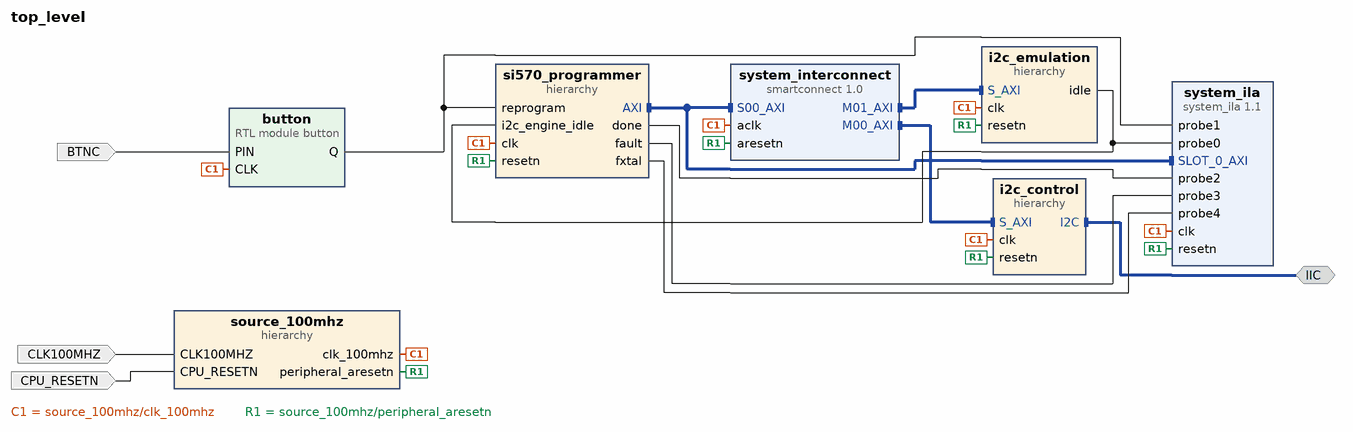
[diagram p0: block diagram of the top level]
# Vivado block design top_level, xc7a100tcsg324-1, Vivado 2021.1
create_bd_design top_level

create_bd_intf_port -mode Master -vlnv xilinx.com:interface:iic_rtl:1.0 IIC
create_bd_port -dir I -type clk CLK100MHZ
set_property -dict {CONFIG.ASSOCIATED_RESET CPU_RESETN} [get_bd_ports CLK100MHZ]
create_bd_port -dir I -type rst CPU_RESETN
create_bd_port -dir I BTNC

create_bd_cell -type hier source_100mhz
create_bd_cell -type hier i2c_control
create_bd_cell -type hier si570_programmer
create_bd_cell -type ip -vlnv xilinx.com:ip:smartconnect:1.0 system_interconnect
set_property -dict {CONFIG.NUM_MI 2 CONFIG.NUM_SI 1} [get_bd_cells system_interconnect]
create_bd_cell -type ip -vlnv xilinx.com:ip:system_ila:1.1 system_ila
set_property -dict {CONFIG.C_DATA_DEPTH 2048 CONFIG.C_MON_TYPE MIX CONFIG.C_NUM_OF_PROBES 5} [get_bd_cells system_ila]
create_bd_cell -type hier i2c_emulation
create_bd_cell -type module -reference button button

# ---- hierarchy /source_100mhz ----
current_bd_instance /source_100mhz
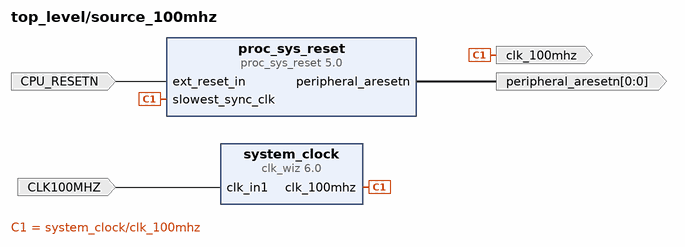
[diagram p1: block diagram inside /source_100mhz]
create_bd_pin -dir I -type clk CLK100MHZ
create_bd_pin -dir O -type clk clk_100mhz
create_bd_pin -dir I -type rst CPU_RESETN
create_bd_pin -dir O -from 0 -to 0 -type rst peripheral_aresetn

create_bd_cell -type ip -vlnv xilinx.com:ip:clk_wiz:6.0 system_clock
set_property -dict [list \
  CONFIG.CLKOUT1_DRIVES BUFGCE \
  CONFIG.CLKOUT2_DRIVES BUFGCE \
  CONFIG.CLKOUT3_DRIVES BUFGCE \
  CONFIG.CLKOUT4_DRIVES BUFGCE \
  CONFIG.CLKOUT5_DRIVES BUFGCE \
  CONFIG.CLKOUT6_DRIVES BUFGCE \
  CONFIG.CLKOUT7_DRIVES BUFGCE \
  CONFIG.CLK_OUT1_PORT clk_100mhz \
  CONFIG.FEEDBACK_SOURCE FDBK_AUTO \
  CONFIG.USE_LOCKED false \
  CONFIG.USE_RESET false \
  CONFIG.USE_SAFE_CLOCK_STARTUP true \
] [get_bd_cells system_clock]
create_bd_cell -type ip -vlnv xilinx.com:ip:proc_sys_reset:5.0 proc_sys_reset

# ---- hierarchy /i2c_control ----
current_bd_instance /i2c_control
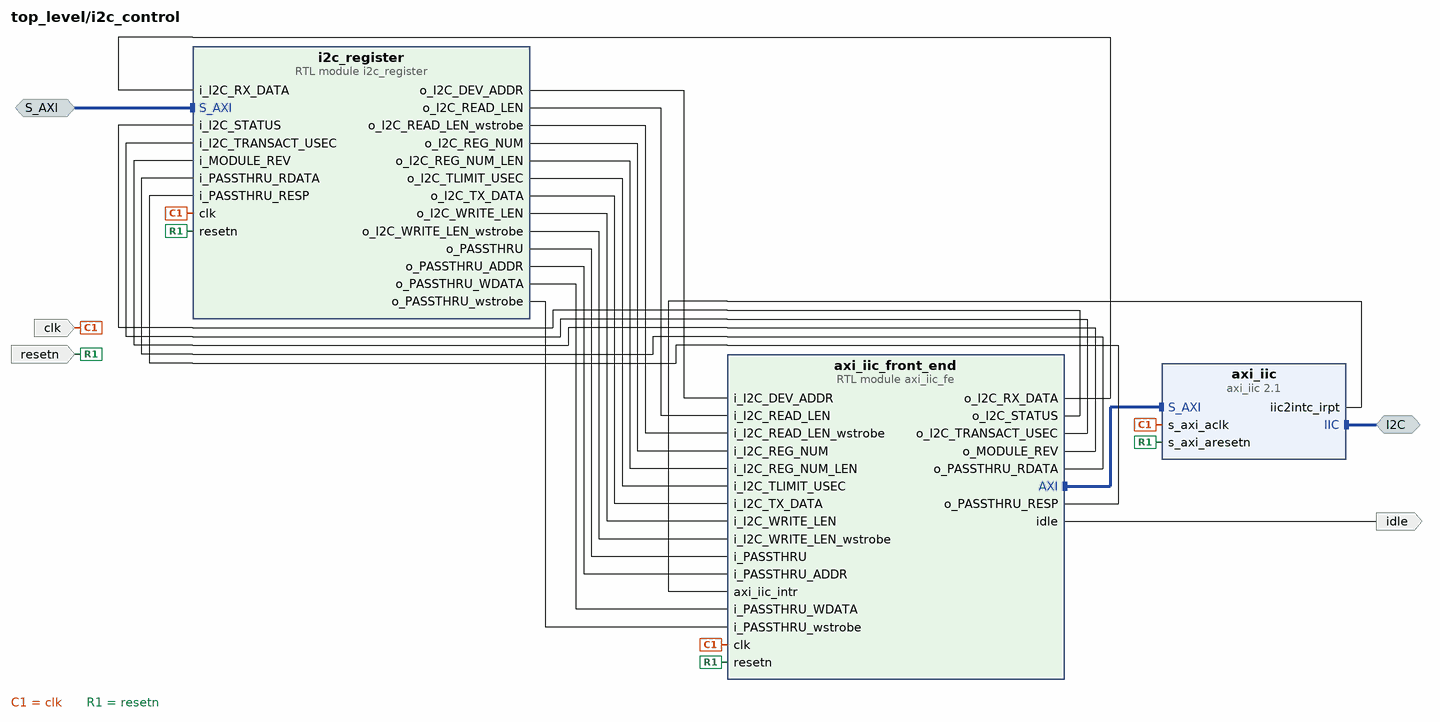
[diagram p2: block diagram inside /i2c_control]
create_bd_intf_pin -mode Master -vlnv xilinx.com:interface:iic_rtl:1.0 I2C
create_bd_intf_pin -mode Slave -vlnv xilinx.com:interface:aximm_rtl:1.0 S_AXI
create_bd_pin -dir I -type clk clk
create_bd_pin -dir I -type rst resetn
create_bd_pin -dir O idle

create_bd_cell -type ip -vlnv xilinx.com:ip:axi_iic:2.1 axi_iic
create_bd_cell -type module -reference axi_iic_fe axi_iic_front_end
create_bd_cell -type module -reference i2c_register i2c_register

# ---- hierarchy /si570_programmer ----
current_bd_instance /si570_programmer
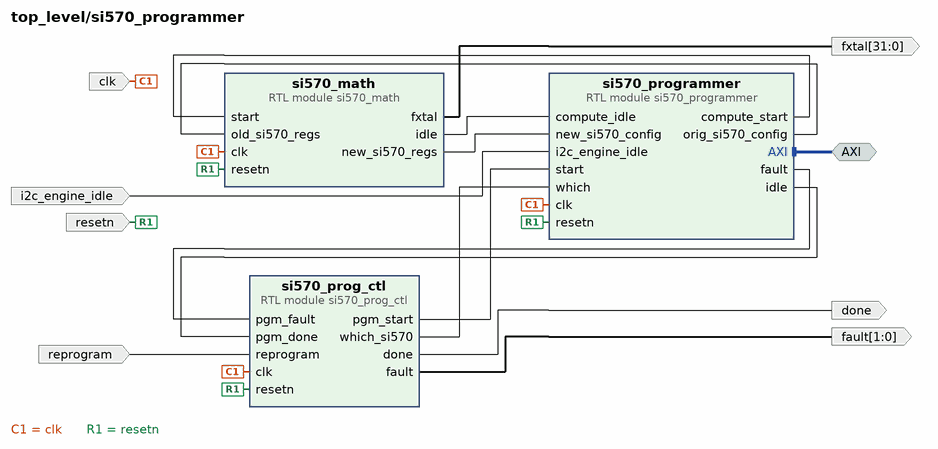
[diagram p3: block diagram inside /si570_programmer]
create_bd_intf_pin -mode Master -vlnv xilinx.com:interface:aximm_rtl:1.0 AXI
create_bd_pin -dir I -type clk clk
create_bd_pin -dir I -type rst resetn
create_bd_pin -dir I i2c_engine_idle
create_bd_pin -dir O -from 1 -to 0 fault
create_bd_pin -dir O done
create_bd_pin -dir O -from 31 -to 0 fxtal
create_bd_pin -dir I reprogram

create_bd_cell -type module -reference si570_programmer si570_programmer
create_bd_cell -type module -reference si570_math si570_math
create_bd_cell -type module -reference si570_prog_ctl si570_prog_ctl

# ---- hierarchy /i2c_emulation ----
current_bd_instance /i2c_emulation
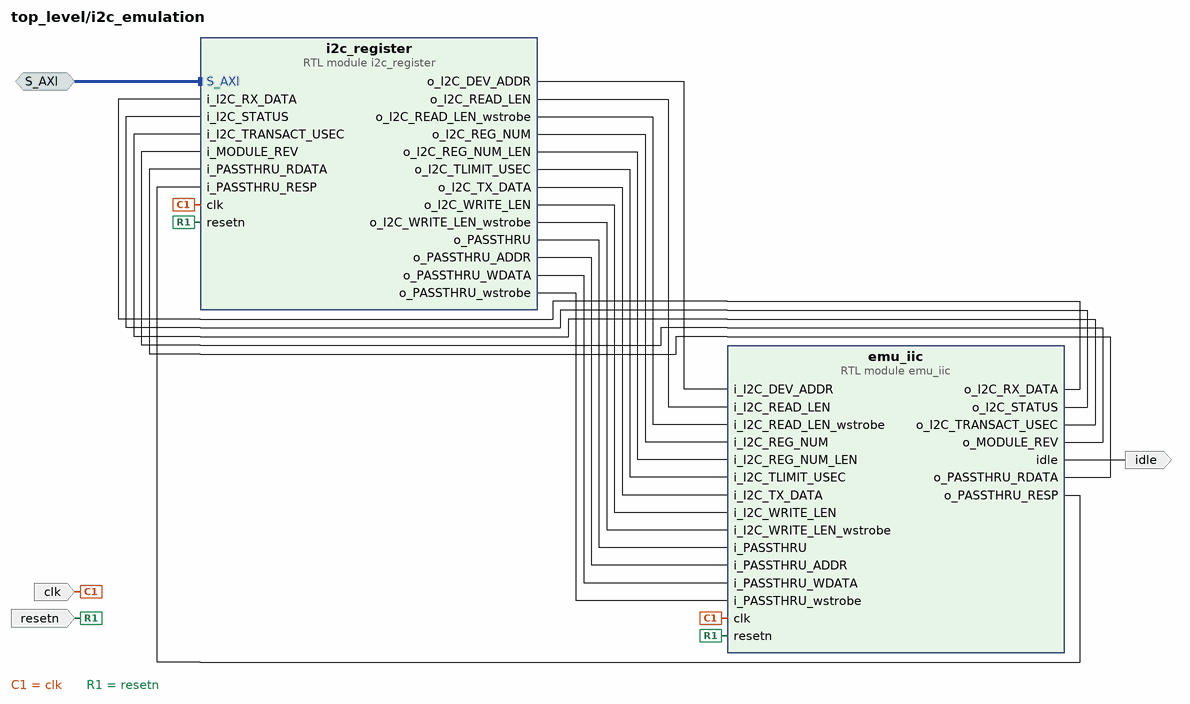
[diagram p4: block diagram inside /i2c_emulation]
create_bd_intf_pin -mode Slave -vlnv xilinx.com:interface:aximm_rtl:1.0 S_AXI
create_bd_pin -dir O idle
create_bd_pin -dir I -type clk clk
create_bd_pin -dir I -type rst resetn

create_bd_cell -type module -reference emu_iic emu_iic
create_bd_cell -type module -reference i2c_register i2c_register

# ---- connections ----

current_bd_instance /source_100mhz
connect_bd_net [get_bd_pins CLK100MHZ] [get_bd_pins system_clock/clk_in1]
connect_bd_net [get_bd_pins CPU_RESETN] [get_bd_pins proc_sys_reset/ext_reset_in]
connect_bd_net [get_bd_pins proc_sys_reset/peripheral_aresetn] [get_bd_pins peripheral_aresetn]
connect_bd_net [get_bd_pins system_clock/clk_100mhz] [get_bd_pins clk_100mhz] [get_bd_pins proc_sys_reset/slowest_sync_clk]

current_bd_instance /i2c_control
connect_bd_intf_net [get_bd_intf_pins I2C] [get_bd_intf_pins axi_iic/IIC]
connect_bd_intf_net [get_bd_intf_pins S_AXI] [get_bd_intf_pins i2c_register/S_AXI]
connect_bd_intf_net -intf_net axi_iic_fe_0_AXI [get_bd_intf_pins axi_iic/S_AXI] [get_bd_intf_pins axi_iic_front_end/AXI]
connect_bd_net -net axi_iic_0_iic2intc_irpt [get_bd_pins axi_iic/iic2intc_irpt] [get_bd_pins axi_iic_front_end/axi_iic_intr]
connect_bd_net -net axi_iic_fe_0_o_I2C_RX_DATA [get_bd_pins axi_iic_front_end/o_I2C_RX_DATA] [get_bd_pins i2c_register/i_I2C_RX_DATA]
connect_bd_net -net axi_iic_fe_0_o_I2C_STATUS [get_bd_pins axi_iic_front_end/o_I2C_STATUS] [get_bd_pins i2c_register/i_I2C_STATUS]
connect_bd_net -net axi_iic_fe_0_o_I2C_TRANSACT_USEC [get_bd_pins axi_iic_front_end/o_I2C_TRANSACT_USEC] \
  [get_bd_pins i2c_register/i_I2C_TRANSACT_USEC]
connect_bd_net -net axi_iic_fe_0_o_MODULE_REV [get_bd_pins axi_iic_front_end/o_MODULE_REV] [get_bd_pins i2c_register/i_MODULE_REV]
connect_bd_net -net axi_iic_fe_0_o_PASSTHRU_RDATA [get_bd_pins axi_iic_front_end/o_PASSTHRU_RDATA] [get_bd_pins i2c_register/i_PASSTHRU_RDATA]
connect_bd_net -net axi_iic_fe_0_o_PASSTHRU_RESP [get_bd_pins axi_iic_front_end/o_PASSTHRU_RESP] [get_bd_pins i2c_register/i_PASSTHRU_RESP]
connect_bd_net [get_bd_pins axi_iic_front_end/idle] [get_bd_pins idle]
connect_bd_net [get_bd_pins clk] [get_bd_pins axi_iic/s_axi_aclk] [get_bd_pins axi_iic_front_end/clk] [get_bd_pins i2c_register/clk]
connect_bd_net -net i2c_register_0_o_I2C_DEV_ADDR [get_bd_pins i2c_register/o_I2C_DEV_ADDR] [get_bd_pins axi_iic_front_end/i_I2C_DEV_ADDR]
connect_bd_net -net i2c_register_0_o_I2C_READ_LEN [get_bd_pins i2c_register/o_I2C_READ_LEN] [get_bd_pins axi_iic_front_end/i_I2C_READ_LEN]
connect_bd_net -net i2c_register_0_o_I2C_READ_LEN_wstrobe [get_bd_pins i2c_register/o_I2C_READ_LEN_wstrobe] \
  [get_bd_pins axi_iic_front_end/i_I2C_READ_LEN_wstrobe]
connect_bd_net -net i2c_register_0_o_I2C_REG_NUM [get_bd_pins i2c_register/o_I2C_REG_NUM] [get_bd_pins axi_iic_front_end/i_I2C_REG_NUM]
connect_bd_net -net i2c_register_0_o_I2C_REG_NUM_LEN [get_bd_pins i2c_register/o_I2C_REG_NUM_LEN] [get_bd_pins axi_iic_front_end/i_I2C_REG_NUM_LEN]
connect_bd_net -net i2c_register_0_o_I2C_TLIMIT_USEC [get_bd_pins i2c_register/o_I2C_TLIMIT_USEC] [get_bd_pins axi_iic_front_end/i_I2C_TLIMIT_USEC]
connect_bd_net -net i2c_register_0_o_I2C_TX_DATA [get_bd_pins i2c_register/o_I2C_TX_DATA] [get_bd_pins axi_iic_front_end/i_I2C_TX_DATA]
connect_bd_net -net i2c_register_0_o_I2C_WRITE_LEN [get_bd_pins i2c_register/o_I2C_WRITE_LEN] [get_bd_pins axi_iic_front_end/i_I2C_WRITE_LEN]
connect_bd_net -net i2c_register_0_o_I2C_WRITE_LEN_wstrobe [get_bd_pins i2c_register/o_I2C_WRITE_LEN_wstrobe] \
  [get_bd_pins axi_iic_front_end/i_I2C_WRITE_LEN_wstrobe]
connect_bd_net -net i2c_register_0_o_PASSTHRU [get_bd_pins i2c_register/o_PASSTHRU] [get_bd_pins axi_iic_front_end/i_PASSTHRU]
connect_bd_net -net i2c_register_0_o_PASSTHRU_ADDR [get_bd_pins i2c_register/o_PASSTHRU_ADDR] [get_bd_pins axi_iic_front_end/i_PASSTHRU_ADDR]
connect_bd_net -net i2c_register_0_o_PASSTHRU_WDATA [get_bd_pins i2c_register/o_PASSTHRU_WDATA] [get_bd_pins axi_iic_front_end/i_PASSTHRU_WDATA]
connect_bd_net -net i2c_register_0_o_PASSTHRU_wstrobe [get_bd_pins i2c_register/o_PASSTHRU_wstrobe] [get_bd_pins axi_iic_front_end/i_PASSTHRU_wstrobe]
connect_bd_net [get_bd_pins resetn] [get_bd_pins axi_iic/s_axi_aresetn] [get_bd_pins axi_iic_front_end/resetn] [get_bd_pins i2c_register/resetn]

current_bd_instance /si570_programmer
connect_bd_intf_net [get_bd_intf_pins AXI] [get_bd_intf_pins si570_programmer/AXI]
connect_bd_net -net i2c_control_idle [get_bd_pins i2c_engine_idle] [get_bd_pins si570_programmer/i2c_engine_idle]
connect_bd_net -net repogram_0_1 [get_bd_pins reprogram] [get_bd_pins si570_prog_ctl/reprogram]
connect_bd_net -net si570_compute_idle [get_bd_pins si570_math/idle] [get_bd_pins si570_programmer/compute_idle]
connect_bd_net -net si570_compute_si570_regs_out [get_bd_pins si570_math/new_si570_regs] [get_bd_pins si570_programmer/new_si570_config]
connect_bd_net [get_bd_pins si570_math/fxtal] [get_bd_pins fxtal]
connect_bd_net -net si570_prog_ctl_0_pgm_start [get_bd_pins si570_prog_ctl/pgm_start] [get_bd_pins si570_programmer/start]
connect_bd_net -net si570_prog_ctl_0_which_si570 [get_bd_pins si570_prog_ctl/which_si570] [get_bd_pins si570_programmer/which]
connect_bd_net [get_bd_pins si570_prog_ctl/done] [get_bd_pins done]
connect_bd_net [get_bd_pins si570_prog_ctl/fault] [get_bd_pins fault]
connect_bd_net [get_bd_pins si570_programmer/compute_start] [get_bd_pins si570_math/start]
connect_bd_net [get_bd_pins si570_programmer/fault] [get_bd_pins si570_prog_ctl/pgm_fault]
connect_bd_net [get_bd_pins si570_programmer/idle] [get_bd_pins si570_prog_ctl/pgm_done]
connect_bd_net [get_bd_pins si570_programmer/orig_si570_config] [get_bd_pins si570_math/old_si570_regs]
connect_bd_net -net source_100mhz_clk_100mhz [get_bd_pins clk] \
  [get_bd_pins si570_programmer/clk] [get_bd_pins si570_math/clk] [get_bd_pins si570_prog_ctl/clk]
connect_bd_net -net source_100mhz_peripheral_aresetn [get_bd_pins resetn] \
  [get_bd_pins si570_programmer/resetn] [get_bd_pins si570_math/resetn] [get_bd_pins si570_prog_ctl/resetn]

current_bd_instance /i2c_emulation
connect_bd_intf_net [get_bd_intf_pins S_AXI] [get_bd_intf_pins i2c_register/S_AXI]
connect_bd_net -net clk_0_1 [get_bd_pins clk] [get_bd_pins emu_iic/clk] [get_bd_pins i2c_register/clk]
connect_bd_net [get_bd_pins emu_iic/idle] [get_bd_pins idle]
connect_bd_net [get_bd_pins emu_iic/o_I2C_RX_DATA] [get_bd_pins i2c_register/i_I2C_RX_DATA]
connect_bd_net [get_bd_pins emu_iic/o_I2C_STATUS] [get_bd_pins i2c_register/i_I2C_STATUS]
connect_bd_net [get_bd_pins emu_iic/o_I2C_TRANSACT_USEC] [get_bd_pins i2c_register/i_I2C_TRANSACT_USEC]
connect_bd_net [get_bd_pins emu_iic/o_MODULE_REV] [get_bd_pins i2c_register/i_MODULE_REV]
connect_bd_net [get_bd_pins emu_iic/o_PASSTHRU_RDATA] [get_bd_pins i2c_register/i_PASSTHRU_RDATA]
connect_bd_net [get_bd_pins emu_iic/o_PASSTHRU_RESP] [get_bd_pins i2c_register/i_PASSTHRU_RESP]
connect_bd_net [get_bd_pins i2c_register/o_I2C_DEV_ADDR] [get_bd_pins emu_iic/i_I2C_DEV_ADDR]
connect_bd_net [get_bd_pins i2c_register/o_I2C_READ_LEN] [get_bd_pins emu_iic/i_I2C_READ_LEN]
connect_bd_net [get_bd_pins i2c_register/o_I2C_READ_LEN_wstrobe] [get_bd_pins emu_iic/i_I2C_READ_LEN_wstrobe]
connect_bd_net [get_bd_pins i2c_register/o_I2C_REG_NUM] [get_bd_pins emu_iic/i_I2C_REG_NUM]
connect_bd_net [get_bd_pins i2c_register/o_I2C_REG_NUM_LEN] [get_bd_pins emu_iic/i_I2C_REG_NUM_LEN]
connect_bd_net [get_bd_pins i2c_register/o_I2C_TLIMIT_USEC] [get_bd_pins emu_iic/i_I2C_TLIMIT_USEC]
connect_bd_net [get_bd_pins i2c_register/o_I2C_TX_DATA] [get_bd_pins emu_iic/i_I2C_TX_DATA]
connect_bd_net [get_bd_pins i2c_register/o_I2C_WRITE_LEN] [get_bd_pins emu_iic/i_I2C_WRITE_LEN]
connect_bd_net [get_bd_pins i2c_register/o_I2C_WRITE_LEN_wstrobe] [get_bd_pins emu_iic/i_I2C_WRITE_LEN_wstrobe]
connect_bd_net [get_bd_pins i2c_register/o_PASSTHRU] [get_bd_pins emu_iic/i_PASSTHRU]
connect_bd_net [get_bd_pins i2c_register/o_PASSTHRU_ADDR] [get_bd_pins emu_iic/i_PASSTHRU_ADDR]
connect_bd_net [get_bd_pins i2c_register/o_PASSTHRU_WDATA] [get_bd_pins emu_iic/i_PASSTHRU_WDATA]
connect_bd_net [get_bd_pins i2c_register/o_PASSTHRU_wstrobe] [get_bd_pins emu_iic/i_PASSTHRU_wstrobe]
connect_bd_net -net resetn_0_1 [get_bd_pins resetn] [get_bd_pins emu_iic/resetn] [get_bd_pins i2c_register/resetn]

current_bd_instance /
connect_bd_intf_net -intf_net i2c_control_IIC_0 [get_bd_intf_ports IIC] [get_bd_intf_pins i2c_control/I2C]
connect_bd_intf_net [get_bd_intf_pins system_interconnect/S00_AXI] [get_bd_intf_pins si570_programmer/AXI]
connect_bd_intf_net [get_bd_intf_pins system_interconnect/S00_AXI] [get_bd_intf_pins system_ila/SLOT_0_AXI]
connect_bd_intf_net -intf_net smartconnect_0_M00_AXI [get_bd_intf_pins system_interconnect/M00_AXI] [get_bd_intf_pins i2c_control/S_AXI]
connect_bd_intf_net [get_bd_intf_pins system_interconnect/M01_AXI] [get_bd_intf_pins i2c_emulation/S_AXI]
connect_bd_net [get_bd_ports CLK100MHZ] [get_bd_pins source_100mhz/CLK100MHZ]
connect_bd_net [get_bd_ports CPU_RESETN] [get_bd_pins source_100mhz/CPU_RESETN]
connect_bd_net -net PIN_0_1 [get_bd_ports BTNC] [get_bd_pins button/PIN]
connect_bd_net [get_bd_pins button/Q] [get_bd_pins system_ila/probe1] [get_bd_pins si570_programmer/reprogram]
connect_bd_net -net done [get_bd_pins si570_programmer/done] [get_bd_pins system_ila/probe2]
connect_bd_net -net fault [get_bd_pins si570_programmer/fault] [get_bd_pins system_ila/probe3]
connect_bd_net -net fxtal [get_bd_pins si570_programmer/fxtal] [get_bd_pins system_ila/probe4]
connect_bd_net -net i2c_control_idle [get_bd_pins i2c_emulation/idle] [get_bd_pins si570_programmer/i2c_engine_idle] [get_bd_pins system_ila/probe0]
connect_bd_net [get_bd_pins source_100mhz/clk_100mhz] \
  [get_bd_pins si570_programmer/clk] [get_bd_pins system_interconnect/aclk] [get_bd_pins system_ila/clk] \
  [get_bd_pins i2c_control/clk] [get_bd_pins i2c_emulation/clk] [get_bd_pins button/CLK]
connect_bd_net [get_bd_pins source_100mhz/peripheral_aresetn] \
  [get_bd_pins i2c_control/resetn] [get_bd_pins si570_programmer/resetn] [get_bd_pins system_interconnect/aresetn] \
  [get_bd_pins system_ila/resetn] [get_bd_pins i2c_emulation/resetn]

# ---- address map ----
assign_bd_address -offset 0x00000000 -range 4G -target_address_space [get_bd_addr_spaces i2c_control/axi_iic_front_end/AXI] [get_bd_addr_segs i2c_control/axi_iic/S_AXI/Reg]
assign_bd_address -offset 0x00000000 -range 256 -target_address_space [get_bd_addr_spaces si570_programmer/si570_programmer/AXI] [get_bd_addr_segs i2c_control/i2c_register/S_AXI/reg0]
assign_bd_address -offset 0x00001000 -range 256 -target_address_space [get_bd_addr_spaces si570_programmer/si570_programmer/AXI] [get_bd_addr_segs i2c_emulation/i2c_register/S_AXI/reg0]

validate_bd_design
save_bd_design
